# Altium schematic sheet Sensor_ExpandBoard_DS18B20.SchDoc: Sencor Card
size A4; Revision: V1.1; SheetNumber: 3; SheetTotal: 7; Function: Temperature Sencor
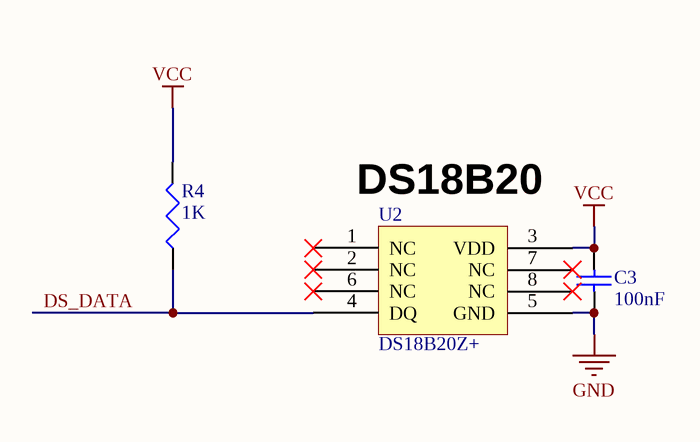
[diagram p0: Sensor_ExpandBoard_DS18B20.SchDoc]

## Parts
C3  100nF  [0603-2]
R4  1K  [R0603]
U2  DS18B20Z+  [SOIC8_N]

## Nets
GND: C3.1 U2.5(GND)
VCC: C3.2 R4.2 U2.3(VDD)
DS_DATA: R4.1 U2.4(DQ)

Not connected (* = marked no-connect by the designer): U2 1(NC)* 2(NC)* 6(NC)* 7(NC)* 8(NC)*

## Notes on the sheet
- (near U2) DS18B20
- 工程名称：
- 图纸大小：
- 日期：
- A4
- 版本号：
- 页码：
- 第
- 共
- 制图：
- 审核：

## Library data of the parts
C3 = Cap: 无极性电容; Published: 8-Jun-2000; LatestRevisionDate: 17-Jul-2002; LatestRevisionNote: Re-released for DXP Platform.; PackageReference: RAD-0.3; Publisher: Altium Limited; Value: 100nF
R4 = Res: Resistor; Published: 8-Jun-2000; LatestRevisionDate: 29-May-2009; LatestRevisionNote: IPC-7351 Footprint Added.; PackageReference: J1-0603; Publisher: Altium Limited; PackageDescription: Chip Resistor; Value: 1K
U2 = DS18B20_SOP8: 温度传感器; Value: DS18B20Z+